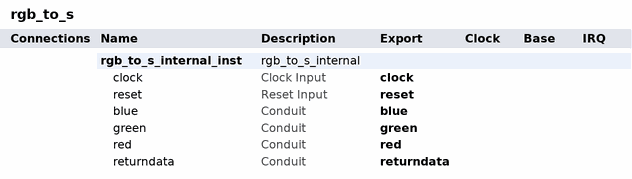
[diagram p0: system contents]
# Platform Designer (Qsys) system rgb_to_s, MAX 10 10M50DAF672I7G
# Parameters at their usual value, and those the tool derives, are not listed.
package require qsys
create_system rgb_to_s
set_project_property DEVICE_FAMILY {MAX 10}
set_project_property DEVICE 10M50DAF672I7G

add_instance rgb_to_s_internal_inst rgb_to_s_internal 1.0
set_instance_property rgb_to_s_internal_inst AUTO_EXPORT true

# exported interfaces
add_interface blue conduit end
set_interface_property blue EXPORT_OF rgb_to_s_internal_inst.blue
add_interface clock clock sink
set_interface_property clock EXPORT_OF rgb_to_s_internal_inst.clock
add_interface green conduit end
set_interface_property green EXPORT_OF rgb_to_s_internal_inst.green
add_interface red conduit end
set_interface_property red EXPORT_OF rgb_to_s_internal_inst.red
add_interface reset reset sink
set_interface_property reset EXPORT_OF rgb_to_s_internal_inst.reset
add_interface returndata conduit end
set_interface_property returndata EXPORT_OF rgb_to_s_internal_inst.returndata

set_interconnect_requirement {$system} qsys_mm.clockCrossingAdapter HANDSHAKE
set_interconnect_requirement {$system} qsys_mm.enableEccProtection FALSE
set_interconnect_requirement {$system} qsys_mm.insertDefaultSlave FALSE
set_interconnect_requirement {$system} qsys_mm.maxAdditionalLatency 1

save_system rgb_to_s.qsys
